# EAGLE schematic luxo (EAGLE 7.3.0)
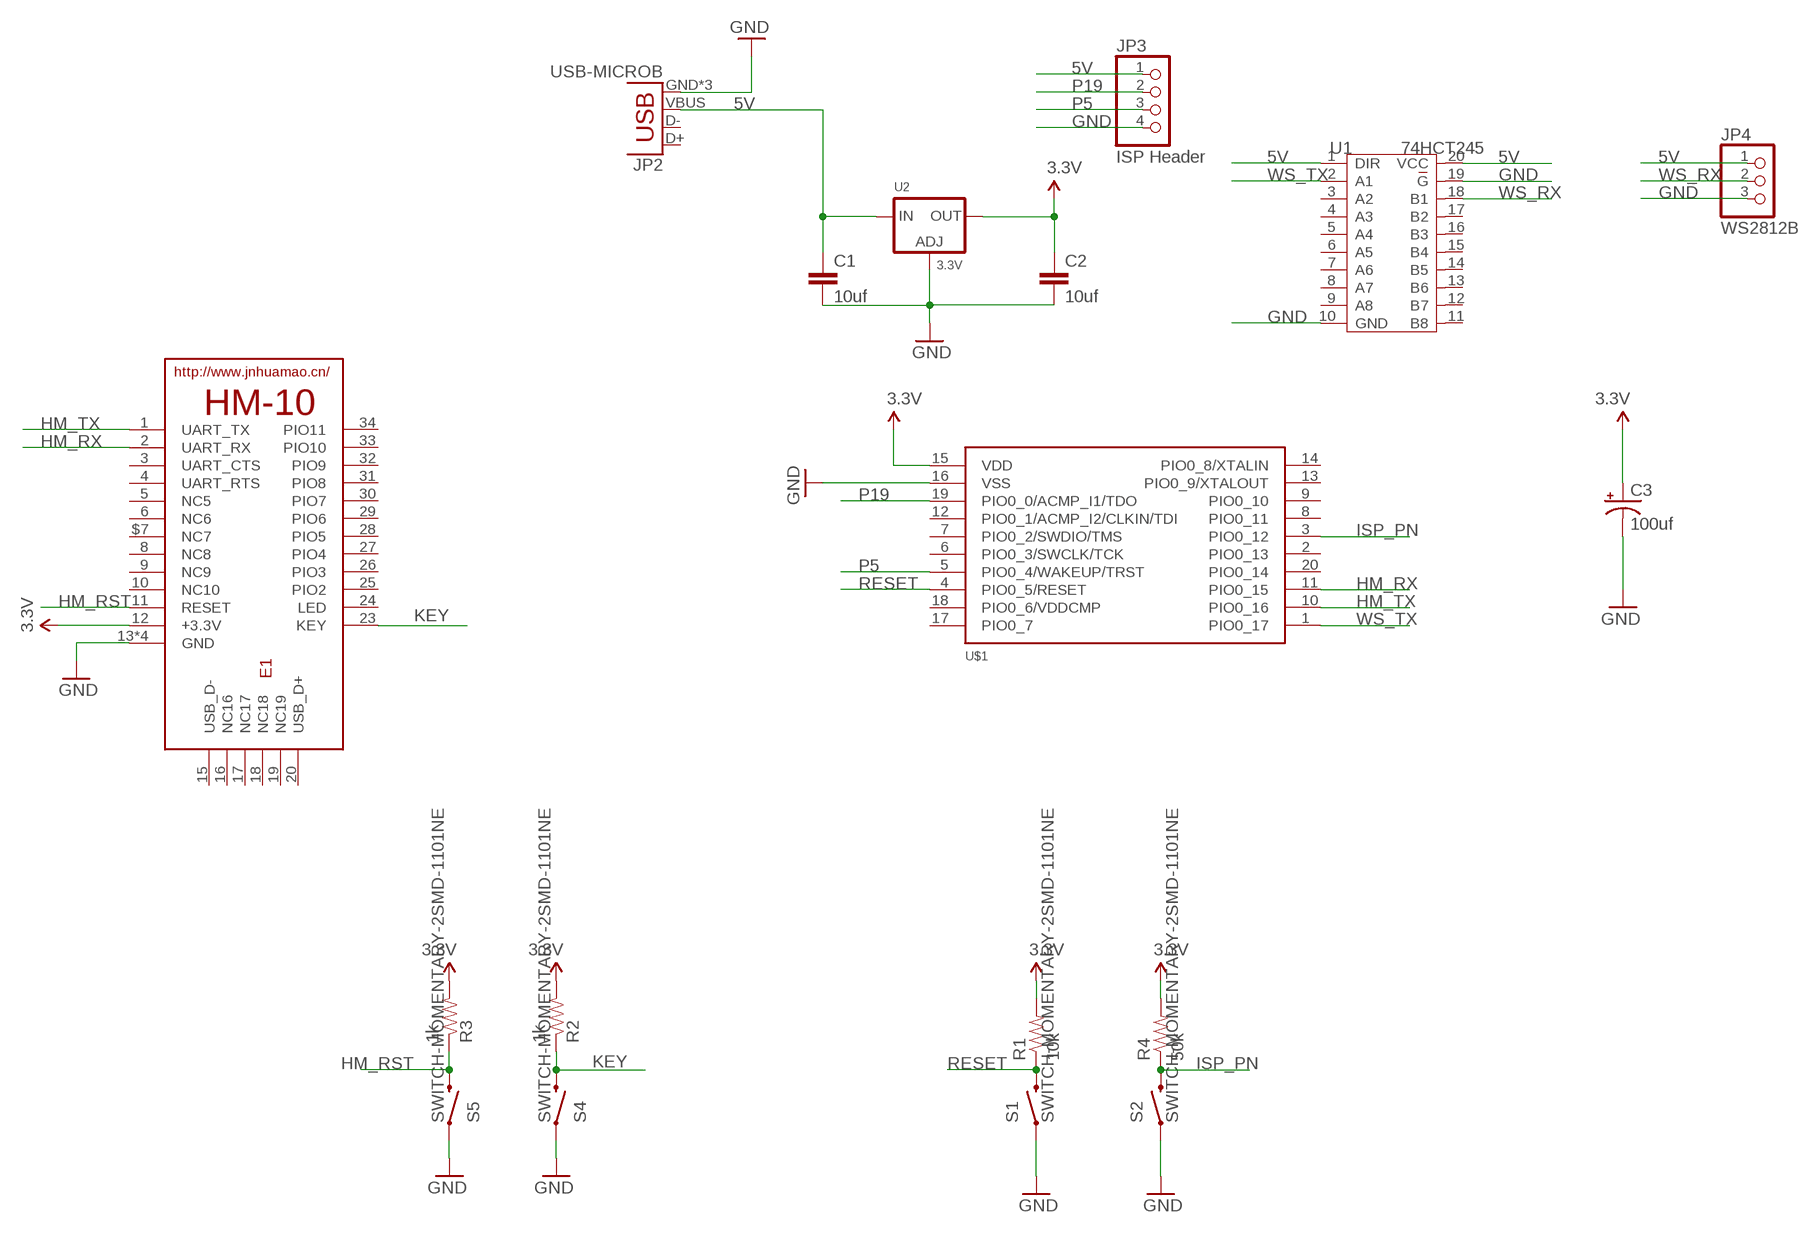
[diagram p0: schematic, sheet 1]

## Parts
C1  10uf  10UF10V10%(0805)  [0805-CAP]
C2  10uf  10UF10V10%(0805)  [0805-CAP]
C3  100uf  100UF-25V-20%(PTH)  [CPOL-RADIAL-100UF-25V]
E1  HM-10-BOARD  [26.9X13X2.2_BOARD]
JP2  USB-MICROB  [USB-MICROB]
JP3  ISP Header  HEADER-1X4ROUND  [1X04_ROUND]
JP4  WS2812B  HEADER-1X3  [1X03_OVAL]
R1  10k  RESISTOR0805-RES  [0805]
R2  1k  RESISTOR0805-RES  [0805]
R3  1k  RESISTOR0805-RES  [0805]
R4  50k  RESISTOR0805-RES  [0805]
S1  SWITCH-MOMENTARY-2SMD-1101NE  [TACTILE-SWITCH-1101NE]
S2  SWITCH-MOMENTARY-2SMD-1101NE  [TACTILE-SWITCH-1101NE]
S4  SWITCH-MOMENTARY-2SMD-1101NE  [TACTILE-SWITCH-1101NE]
S5  SWITCH-MOMENTARY-2SMD-1101NE  [TACTILE-SWITCH-1101NE]
U1  74HCT245  74ACT245-SOP20  [SOP20-10.65]
U2  3.3V  LM1117SOT223-WAVE  [SOT223-W]
U$1  LPC812M101JDH20  [TSSOP20]

## Nets
3.3V: C2.1 C3.1(+) E1.12(+3.3V) R1.2 R2.2 R3.2 R4.2 U2.2(OUT) U$1.15(VDD)
5V: C1.1 JP2.VBUS JP3.1 JP4.1 U1.1(DIR) U1.20(VCC) U2.3(IN)
GND: C1.2 C2.2 C3.2(-) E1.13(GND) E1.14(GND) E1.21(GND) E1.22(GND) JP2.GND JP2.MT1(GND) JP2.MT2(GND) JP3.4 JP4.3 S1.1 S2.1 S4.1 S5.1 U1.10(GND) U1.19(G) U2.1(ADJ) U$1.16(VSS)
HM_RST: E1.11(RESET) R3.1 S5.2
HM_RX: E1.2(UART_RX) U$1.11(PIO0_15)
HM_TX: E1.1(UART_TX) U$1.10(PIO0_16)
ISP_PN: R4.1 S2.2 U$1.3(PIO0_12)
KEY: E1.23(KEY) R2.1 S4.2
P5: JP3.3 U$1.5(PIO0_4/WAKEUP/TRST)
P19: JP3.2 U$1.19(PIO0_0/ACMP_I1/TDO)
RESET: R1.1 S1.2 U$1.4(PIO0_5/RESET)
WS_RX: JP4.2 U1.18(B1)
WS_TX: U1.2(A1) U$1.1(PIO0_17)
Unconnected: E1.3(UART_CTS) E1.4(UART_RTS) E1.5(NC5) E1.6(NC6) E1.8(NC8) E1.9(NC9) E1.10(NC10) E1.15(USB_D-) E1.16(NC16) E1.17(NC17) E1.18(NC18) E1.19(NC19) E1.20(USB_D+) E1.24(LED) E1.25(PIO2) E1.26(PIO3) E1.27(PIO4) E1.28(PIO5) E1.29(PIO6) E1.30(PIO7) E1.31(PIO8) E1.32(PIO9) E1.33(PIO10) E1.34(PIO11) E1.$7(NC7) JP2.D+ JP2.D- U1.3(A2) U1.4(A3) U1.5(A4) U1.6(A5) U1.7(A6) U1.8(A7) U1.9(A8) U1.11(B8) U1.12(B7) U1.13(B6) U1.14(B5) U1.15(B4) U1.16(B3) U1.17(B2) U$1.2(PIO0_13) U$1.6(PIO0_3/SWCLK/TCK) U$1.7(PIO0_2/SWDIO/TMS) U$1.8(PIO0_11) U$1.9(PIO0_10) U$1.12(PIO0_1/ACMP_I2/CLKIN/TDI) U$1.13(PIO0_9/XTALOUT) U$1.14(PIO0_8/XTALIN) U$1.17(PIO0_7) U$1.18(PIO0_6/VDDCMP) U$1.20(PIO0_14)

## Library data of the parts
C1 C2 = SparkFun-Capacitors:10UF10V10%(0805): CAP-11330; PROD_ID: CAP-11330
C3 = SparkFun-Capacitors:100UF-25V-20%(PTH): CAP-08439; PROD_ID: CAP-08439
E1 = JNHuaMao:HM-10: HM Bluetooth module use TI CC2540 or CC2541, Master and slave roles in one, transmission version and remote control version and PIO state acquisition functions in one, Support the AT command modify module parameters, Convenient and flexible.
JP2 = SparkFun-Connectors:USB: USB Connectors USB-B-PTH is fully proven SKU : PRT-00139/CONN-08278 USB-miniB is fully proven SKU : PRT-00587 USB-A-PCB is untested. USB-A-H is throughly reviewed, but untested. Spark Fun Electronics SKU : PRT-00437 USB-B-SMT is throughly reviewed, but untested. Needs silkscreen touching up. USB-A-S has not been used/tested USB-MB-H has not been used/tested USB-MICROB has been used. CONN-09505; PROD_ID: CONN-09505
JP3 = microbuilder:HEADER-1X4: PIN HEADER
JP4 = microbuilder:HEADER-1X3: PIN HEADER
R1-R4 = SparkFun-Resistors:RESISTOR: Resistor Basic schematic elements and footprints for 0603, 1206, and PTH resistors.
S1 S2 S4 S5 = SparkFun-Electromechanical:SWITCH-MOMENTARY-2: Various NO switches- pushbuttons, reed, etc; PROD_ID: SWCH-00815
U1 = TFT Touch:74ACT245
U2 = microbuilder:LM1117: LM1117 Voltage Regulator LM1117 Adjustable Voltage regulator [Digikey: LM1117IMP-ADJDKR-ND] LM1117 3.3V Voltage regulator [AP1117E33GDIDKR-ND] LM1117 5.0V Voltage regulator [AP1117E50GDIDKR-ND] SOT223-REFLOW - SOT223 package for solder paste/reflow ovens SOT223-WAVE - SOT223 package for hand-soldering (larger pads) Note: For the fixed-voltage regulators, simply set the ADJ pin to GND.
U$1 = LPC800:LPC812M101JDH20